# Altium schematic sheet [1]-COVER_PAGE.SchDoc
size A4
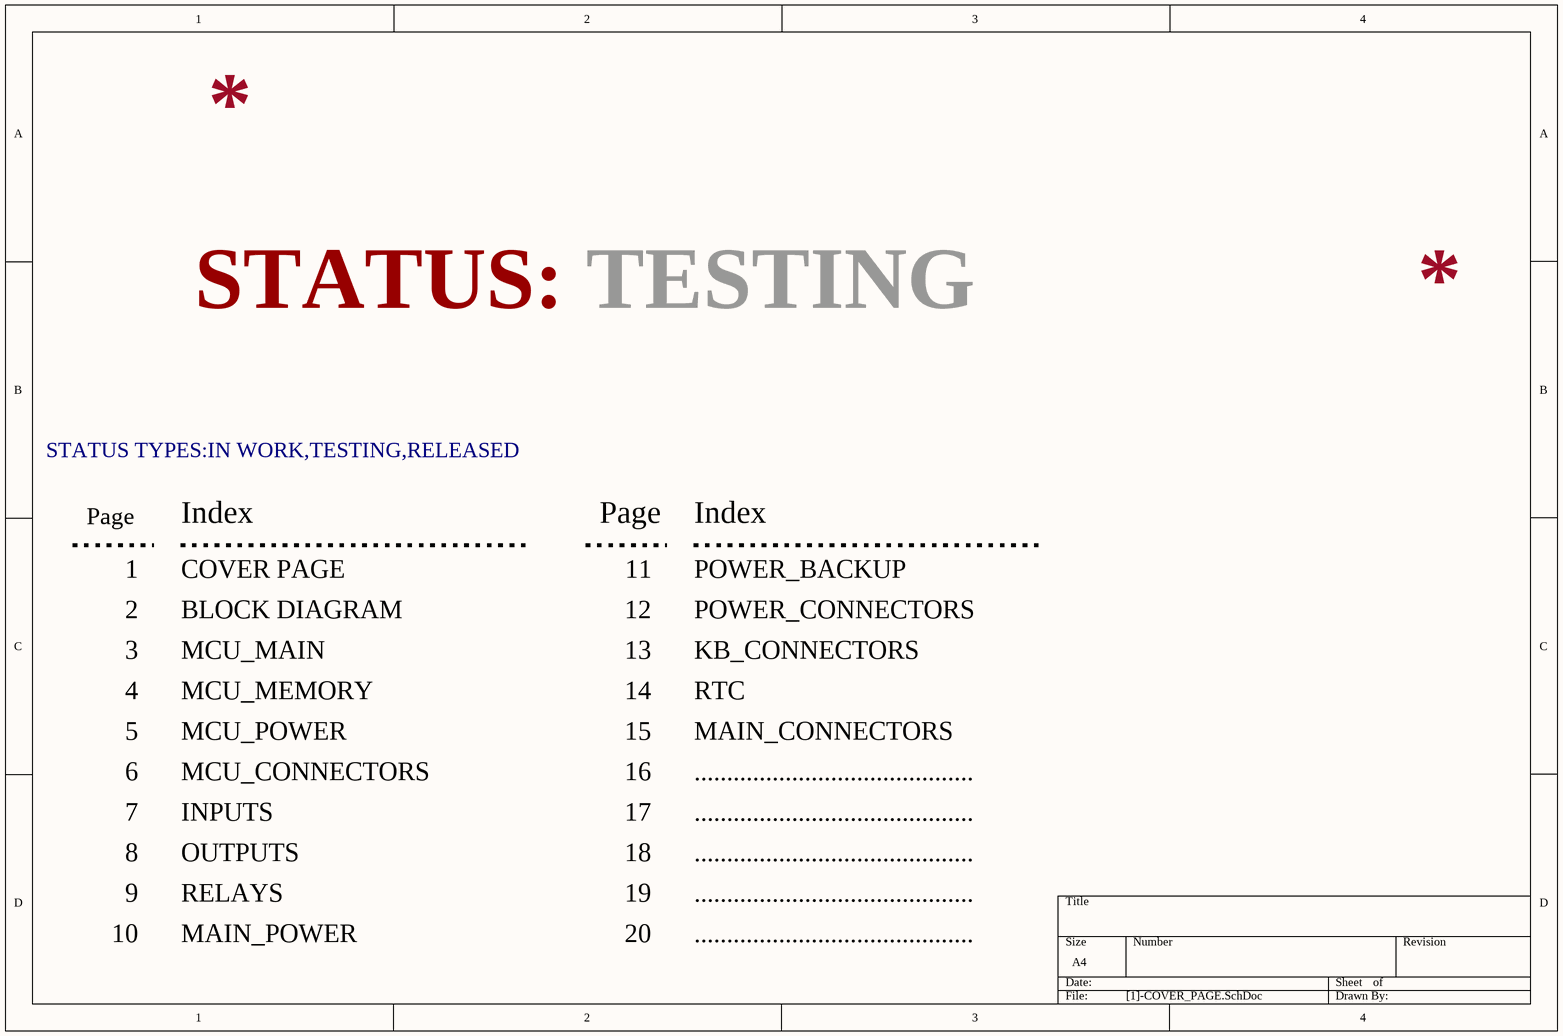
[diagram p0: [1]-COVER_PAGE.SchDoc]

## Notes on the sheet
- STATUS:
- TESTING
- STATUS TYPES:IN WORK,TESTING,RELEASED
- Page
- 1
- Index
- COVER PAGE
- 11
- POWER_BACKUP
- 2
- BLOCK DIAGRAM
- 12
- POWER_CONNECTORS
- 3
- 4
- MCU_MAIN
- MCU_MEMORY
- 13
- 14
- RTC
- KB_CONNECTORS
- 5
- 6
- MCU_POWER
- MCU_CONNECTORS
- 15
- 16
- MAIN_CONNECTORS
- ...........................................
- 7
- INPUTS
- 17
- 8
- 9
- OUTPUTS
- RELAYS
- 18
- 19
- 10
- MAIN_POWER
- 20